# EAGLE design controls_rev_3 (EAGLE 8.3.2)
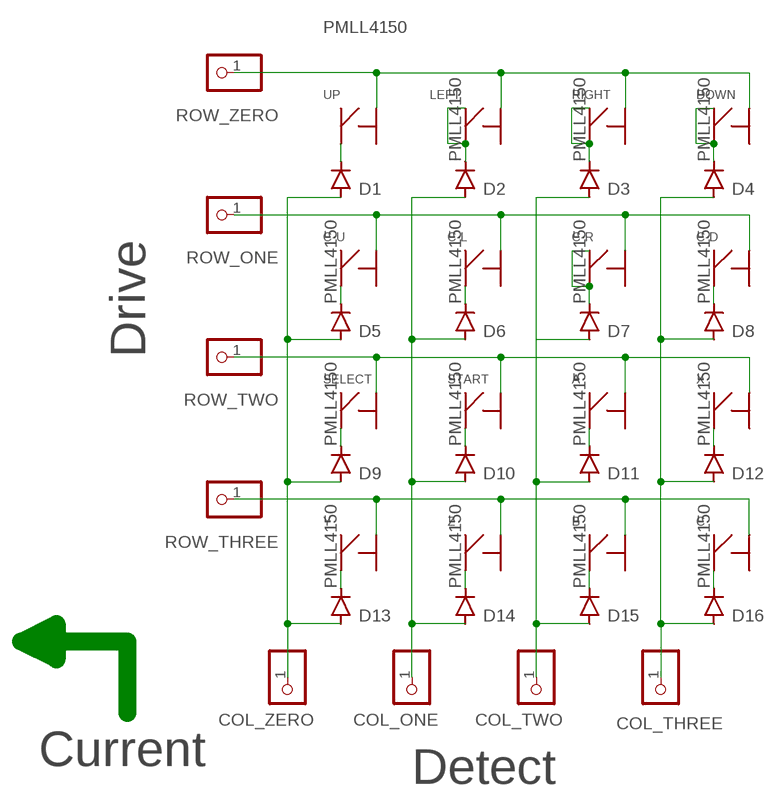
[diagram p0: schematic, sheet 1]

## Parts
A  EVQQ2  [TACT]
B  EVQQ2  [TACT]
C  EVQQ2  [TACT]
C-D  EVQQ2  [TACT]
C-L  EVQQ2  [TACT]
C-R  EVQQ2  [TACT]
C-U  EVQQ2  [TACT]
COL_ONE  PINHD-1X1  [1X01]
COL_THREE  PINHD-1X1  [1X01]
COL_TWO  PINHD-1X1  [1X01]
COL_ZERO  PINHD-1X1  [1X01]
D1  PMLL4150  [SOD80C]
D2  PMLL4150  [SOD80C]
D3  PMLL4150  [SOD80C]
D4  PMLL4150  [SOD80C]
D5  PMLL4150  [SOD80C]
D6  PMLL4150  [SOD80C]
D7  PMLL4150  [SOD80C]
D8  PMLL4150  [SOD80C]
D9  PMLL4150  [SOD80C]
D10  PMLL4150  [SOD80C]
D11  PMLL4150  [SOD80C]
D12  PMLL4150  [SOD80C]
D13  PMLL4150  [SOD80C]
D14  PMLL4150  [SOD80C]
D15  PMLL4150  [SOD80C]
D16  PMLL4150  [SOD80C]
DOWN  EVQQ2  [TACT]
LEFT  EVQQ2  [TACT]
RIGHT  EVQQ2  [TACT]
ROW_ONE  PINHD-1X1  [1X01]
ROW_THREE  PINHD-1X1  [1X01]
ROW_TWO  PINHD-1X1  [1X01]
ROW_ZERO  PINHD-1X1  [1X01]
SELECT  EVQQ2  [TACT]
START  EVQQ2  [TACT]
UP  EVQQ2  [TACT]
X  EVQQ2  [TACT]
Y  EVQQ2  [TACT]
Z  EVQQ2  [TACT]

## Nets
1: D1.C UP.PIN0@0(PIN0)
COL_ONE: COL_ONE.1 D2.A D6.A D10.A D14.A
COL_THREE: COL_THREE.1 D4.A D8.A D12.A D16.A
COL_TWO: COL_TWO.1 D3.A D7.A D11.A D15.A
COL_ZERO: COL_ZERO.1 D1.A D5.A D9.A D13.A
N$2: D9.C SELECT.PIN0@0(PIN0)
N$3: C-U.PIN0@0(PIN0) D5.C
N$4: D10.C START.PIN0@0(PIN0)
N$5: D12.C X.PIN0@0(PIN0)
N$6: B.PIN0@0(PIN0) D15.C
N$7: D14.C Z.PIN0@0(PIN0)
N$8: D13.C Y.PIN0@0(PIN0)
N$9: A.PIN0@0(PIN0) D11.C
N$11: C.PIN0@0(PIN0) D16.C
N$12: D2.C LEFT.PIN0@0(PIN0) LEFT.PIN0@1(PIN0)
N$13: D3.C RIGHT.PIN0@0(PIN0) RIGHT.PIN0@1(PIN0)
N$14: D4.C DOWN.PIN0@0(PIN0) DOWN.PIN0@1(PIN0)
N$16: C-L.PIN0@0(PIN0) D6.C
N$17: C-R.PIN0@0(PIN0) C-R.PIN0@1(PIN0) D7.C
N$27: C-D.PIN0@0(PIN0) D8.C
ROW_ONE: C-D.PIN1@1(PIN1) C-L.PIN1@1(PIN1) C-R.PIN1@1(PIN1) C-U.PIN1@1(PIN1) ROW_ONE.1
ROW_THREE: B.PIN1@1(PIN1) C.PIN1@1(PIN1) ROW_THREE.1 Y.PIN1@1(PIN1) Z.PIN1@1(PIN1)
ROW_TWO: A.PIN1@1(PIN1) ROW_TWO.1 SELECT.PIN1@1(PIN1) START.PIN1@1(PIN1) X.PIN1@1(PIN1)
ROW_ZERO: DOWN.PIN1@1(PIN1) LEFT.PIN1@1(PIN1) RIGHT.PIN1@1(PIN1) ROW_ZERO.1 UP.PIN1@1(PIN1)
Unconnected: A.PIN0@1(PIN0) A.PIN1@0(PIN1) B.PIN0@1(PIN0) B.PIN1@0(PIN1) C-D.PIN0@1(PIN0) C-D.PIN1@0(PIN1) C-L.PIN0@1(PIN0) C-L.PIN1@0(PIN1) C-R.PIN1@0(PIN1) C-U.PIN0@1(PIN0) C-U.PIN1@0(PIN1) C.PIN0@1(PIN0) C.PIN1@0(PIN1) DOWN.PIN1@0(PIN1) LEFT.PIN1@0(PIN1) RIGHT.PIN1@0(PIN1) SELECT.PIN0@1(PIN0) SELECT.PIN1@0(PIN1) START.PIN0@1(PIN0) START.PIN1@0(PIN1) UP.PIN0@1(PIN0) UP.PIN1@0(PIN1) X.PIN0@1(PIN0) X.PIN1@0(PIN1) Y.PIN0@1(PIN0) Y.PIN1@0(PIN1) Z.PIN0@1(PIN0) Z.PIN1@0(PIN1)

## Notes on the sheet
- Drive
- Current
- Detect

## Library data of the parts
A B C C-D C-L C-R C-U DOWN LEFT RIGHT SELECT START UP X Y Z = tact_EVQQ2:EVQQ2
COL_ONE COL_THREE COL_TWO COL_ZERO ROW_ONE ROW_THREE ROW_TWO ROW_ZERO = pinhead:PINHD-1X1: PIN HEADER
D1-D16 = diode:PMLL4150: DIODE high speed

## Board
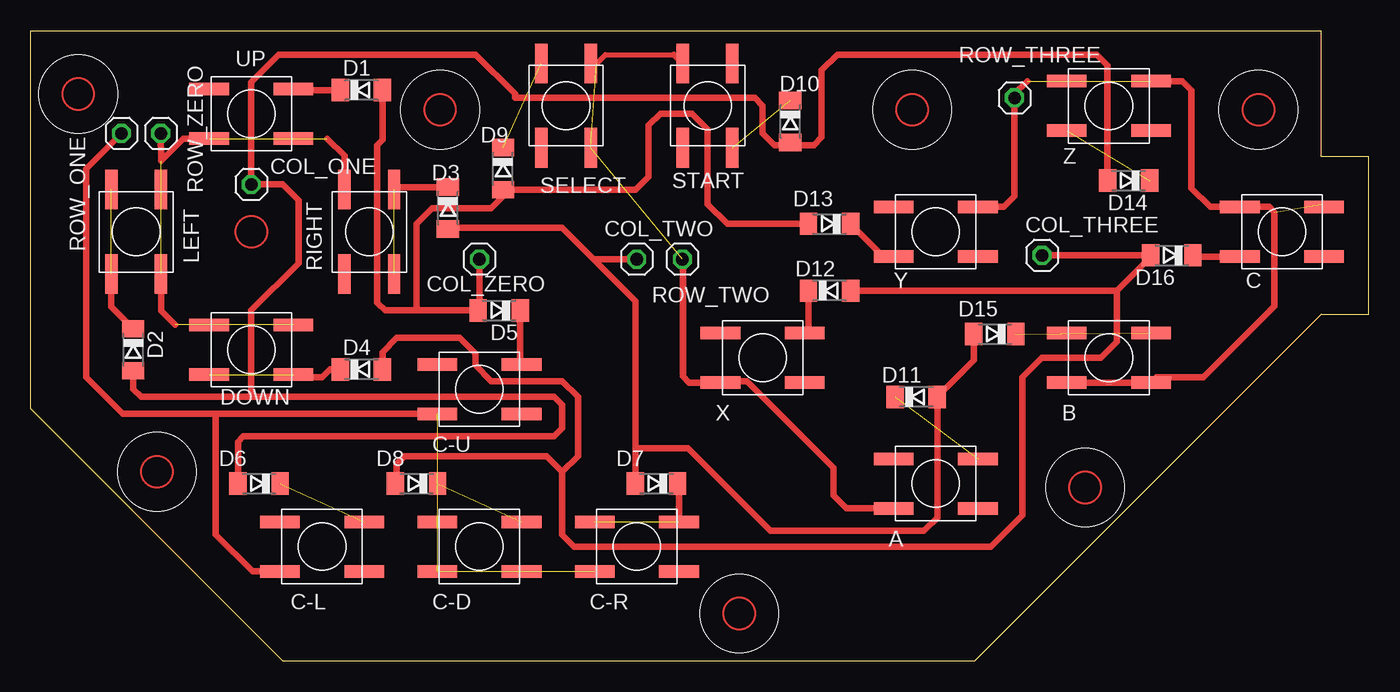
[diagram p1: board, top side]

Size 107.95 x 50.8 mm. Coordinates in mm from the lower left corner, seen from the top.
Outline: 20.32,0 0,20.32 0,50.8 104.14,50.8 104.14,40.64 107.95,40.64 107.95,27.94 104.14,27.94 76.2,0 20.32,0
Copper layers (1*16): Top 0.035mm / dielectric 1.5mm / Bottom 0.035mm
Design rules "default": minimum track width 6mil, minimum drill 0.35mm, track to track 6mil, track to pad 6mil, pad to pad 6mil, via to via 6mil, smd to smd 6mil, copper to edge 40mil, drill to drill 6mil, minimum pad ring 10mil, minimum via ring 8mil, stop-mask expansion 4mil, vias tented up to drill 0mil, thermal gap 10mil

### Footprints (pad centres in the part's own frame; a part is rotated, then mirrored left to right if it is on the bottom)
TACT = smd 3.2 x 1: PIN0@0 3.4,2; PIN0@1 -3.4,2; PIN1@0 3.4,-2; PIN1@1 -3.4,-2
1X01 = drill 1.016 octagon: 1 0,0
SOD80C = smd 1.4 x 1.8: A 1.7,0; C -1.7,0

### Placement (x,y rotation side)
A  73.03,14.28 0 top
B  87,24.44 0 top
C  100.97,34.6 180 top
C-D  36.2,9.2 0 top
C-L  23.5,9.2 0 top
C-R  48.9,9.2 0 top
C-U  36.2,21.9 0 top
COL_ONE  17.78,38.42 0 top
COL_THREE  81.6,32.7 0 top
COL_TWO  48.9,32.39 0 top
COL_ZERO  36.2,32.39 0 top
D1  26.67,46.04 0 top
D2  8.26,25.08 270 top
D3  33.66,36.51 270 top
D4  26.67,23.49 0 top
D5  37.78,28.26 180 top
D6  18.41,14.29 180 top
D7  50.48,14.29 180 top
D8  31.11,14.29 180 top
D9  38.1,39.69 270 top
D10  61.28,43.5 270 top
D11  71.44,21.27 0 top
D12  64.45,29.84 0 top
D13  64.45,35.24 180 top
D14  88.58,38.73 180 top
D15  77.79,26.35 180 top
D16  92.08,32.7 180 top
DOWN  17.78,25.08 180 top
LEFT  8.49,34.6 90 top
RIGHT  27.3,34.6 270 top
ROW_ONE  7.3,42.55 0 top
ROW_THREE  79.38,45.4 0 top
ROW_TWO  52.58,32.39 0 top
ROW_ZERO  10.48,42.55 0 top
SELECT  43.18,44.78 90 top
START  54.61,44.78 270 top
UP  17.78,44.12 0 top
X  59.05,24.44 0 top
Y  73.03,34.6 180 top
Z  87,44.76 180 top

### Tracks (layer width: path | path; a pad name or v marks a point on that pad's centre or on a via)
1
  Top 0.508: D1.C 21.27,46.04 UP.PIN0@0
COL_ONE
  Top 0.508: D2.A 8.26,21.91 8.89,21.27 17.78,21.27 | 17.78,21.27 42.23,21.27 42.86,20.64 42.86,18.73 42.23,18.1 17.14,18.1 16.71,17.67 D6.A | D14.A 86.88,48.05 86.04,48.9 65.09,48.9 63.82,47.62 63.82,42.23 63.18,41.59 61.59,41.59 | 61.59,41.59 61.48,41.59 D10.A | 17.78,21.27 17.78,28.26 21.59,32.07 21.59,37.15 20.32,38.42 COL_ONE.1 17.78,46.67 20,48.9 35.88,48.9 39.05,45.72 39.05,45.4 58.42,45.4 59.05,44.77 59.05,42.55 60.01,41.59 61.59,41.59
COL_THREE
  Top 0.508: 28.26,23.61 D4.A 28.37,24.88 29.53,26.03 34.61,26.03 35.88,24.77 35.88,23.81 37.15,22.54 42.86,22.54 44.13,21.27 44.13,16.51 42.86,15.24 | 87.63,29.84 D12.A | 87.63,29.84 90.38,32.59 D16.A COL_THREE.1 | D8.A 29.53,14.4 29.53,15.87 30.16,16.51 41.59,16.51 42.86,15.24 | 42.86,15.24 42.86,10.16 43.81,9.21 77.47,9.21 80.01,11.75 80.01,22.86 81.6,24.45 86.36,24.45 87.63,25.72 87.63,29.84
COL_TWO
  Top 0.508: D15.A 76.09,24.22 D11.A 73.14,11.54 72.07,10.48 59.69,10.48 53.02,17.15 48.78,17.15 | 48.78,17.15 D7.A | 48.78,17.15 48.78,29.01 45.4,32.39 | 45.4,32.39 42.86,34.93 33.77,34.93 D3.A | COL_TWO.1 45.4,32.39
COL_ZERO
  Top 0.508: D1.A 28.37,42.02 27.94,41.59 27.94,28.89 28.57,28.26 31.11,28.26 | 31.11,28.26 D5.A 36.2,28.37 COL_ZERO.1 | 31.11,28.26 31.11,35.24 32.38,36.51 37.15,36.51 38.1,37.47 D9.A 48.78,37.99 49.85,39.05 49.85,43.18 50.8,44.13 53.34,44.13 54.61,42.86 54.61,36.83 56.2,35.24 D13.A
N$2  (1 unrouted)
N$3
  Top 0.508: C-U.PIN0@0 39.48,24.01 D5.C
N$4  (1 unrouted)
N$5
  Top 0.508: X.PIN0@0 62.75,26.74 D12.C
N$6  (1 unrouted)
N$7  (1 unrouted)
N$8
  Top 0.508: D13.C 68.8,32.6 Y.PIN0@0
N$9  (1 unrouted)
N$11
  Top 0.508: D16.C 93.88,32.6 C.PIN0@0
N$12  (1 unrouted)
  Top 0.508: D2.C 6.49,28.54 LEFT.PIN0@1
N$13  (1 unrouted)
  Top 0.508: D3.C 29.52,38.21 RIGHT.PIN0@1
N$14  (1 unrouted)
  Top 0.508: D4.C 24.13,23.49 23.5,22.86 21.4,22.86 DOWN.PIN0@1
N$16  (1 unrouted)
N$17  (1 unrouted)
  Top 0.508: C-R.PIN0@0 52.3,14.17 D7.C
N$27  (1 unrouted)
ROW_ONE  (2 unrouted)
  Top 0.508: 14.92,19.9 C-U.PIN1@1 | 14.92,19.9 7.39,19.9 4.45,22.85 4.45,39.69 ROW_ONE.1 | C-L.PIN1@1 17.88,7.2 14.92,10.16 14.92,19.9
ROW_THREE  (2 unrouted)
  Top 0.508: B.PIN1@1 90.39,22.44 90.81,22.86 94.61,22.86 100.33,28.58 100.33,36.2 99.92,36.6 97.47,36.6 95.16,36.6 93.66,38.1 93.66,46.04 92.94,46.76 Z.PIN1@1 | 104.14,36.83 C.PIN1@1 | Y.PIN1@1 78.51,36.6 79.38,37.47 ROW_THREE.1 79.38,45.72 80.42,46.76
ROW_TWO  (2 unrouted)
  Top 0.406: 45.63,48.18 46.35,48.9 51.89,48.9 | ROW_TWO.1 52.58,31.78 52.61,31.75
  Top 0.508: 51.89,48.9 START.PIN1@1 | A.PIN1@1 65.83,12.28 64.77,13.33 64.77,15.56 57.78,22.54 55.76,22.54 X.PIN1@1 53.12,22.44 52.61,22.95 52.61,31.75
ROW_ZERO  (3 unrouted)
  Top 0.508: LEFT.PIN1@1 10.49,28.24 11.65,27.08 | UP.PIN1@1 12.28,42.12 10.49,40.34 ROW_ZERO.1 | RIGHT.PIN1@1 25.3,40.73 23.91,42.12
(copper drawn outside any net)
  shapes: Top circle x8